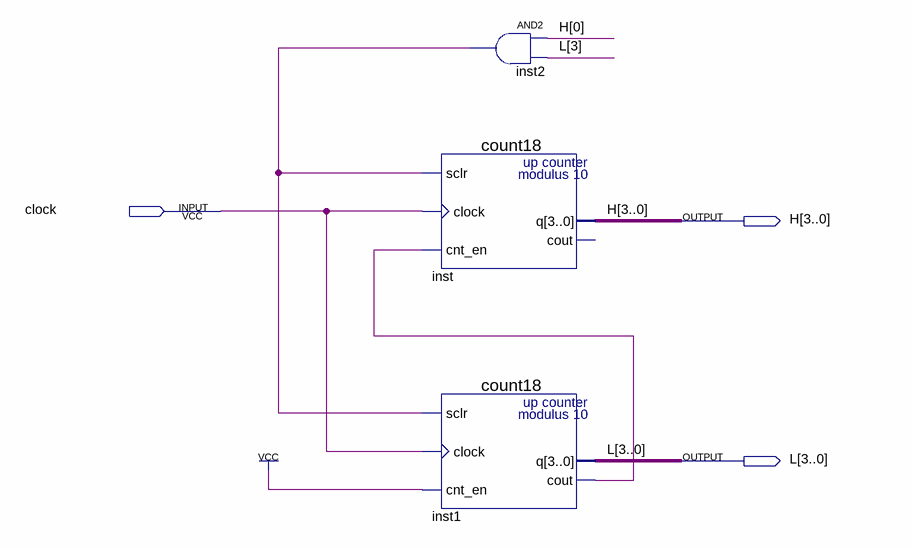
[diagram p0: schematic sheet]
// Quartus schematic count18.bdf as structural Verilog: 3 symbols, 3 pins
module count18 (
  input  clock,
  output [3:0] H,
  output [3:0] L
);

  wire inst1_cout, inst2_out;

  and inst2 (inst2_out, H[0], L[3]);
  count18 inst (.sclr(inst2_out), .clock(clock), .cnt_en(inst1_cout), .q(H));  // open: cout
  count18 inst1 (.sclr(inst2_out), .clock(clock), .cnt_en(1'b1), .q(L), .cout(inst1_cout));
endmodule
